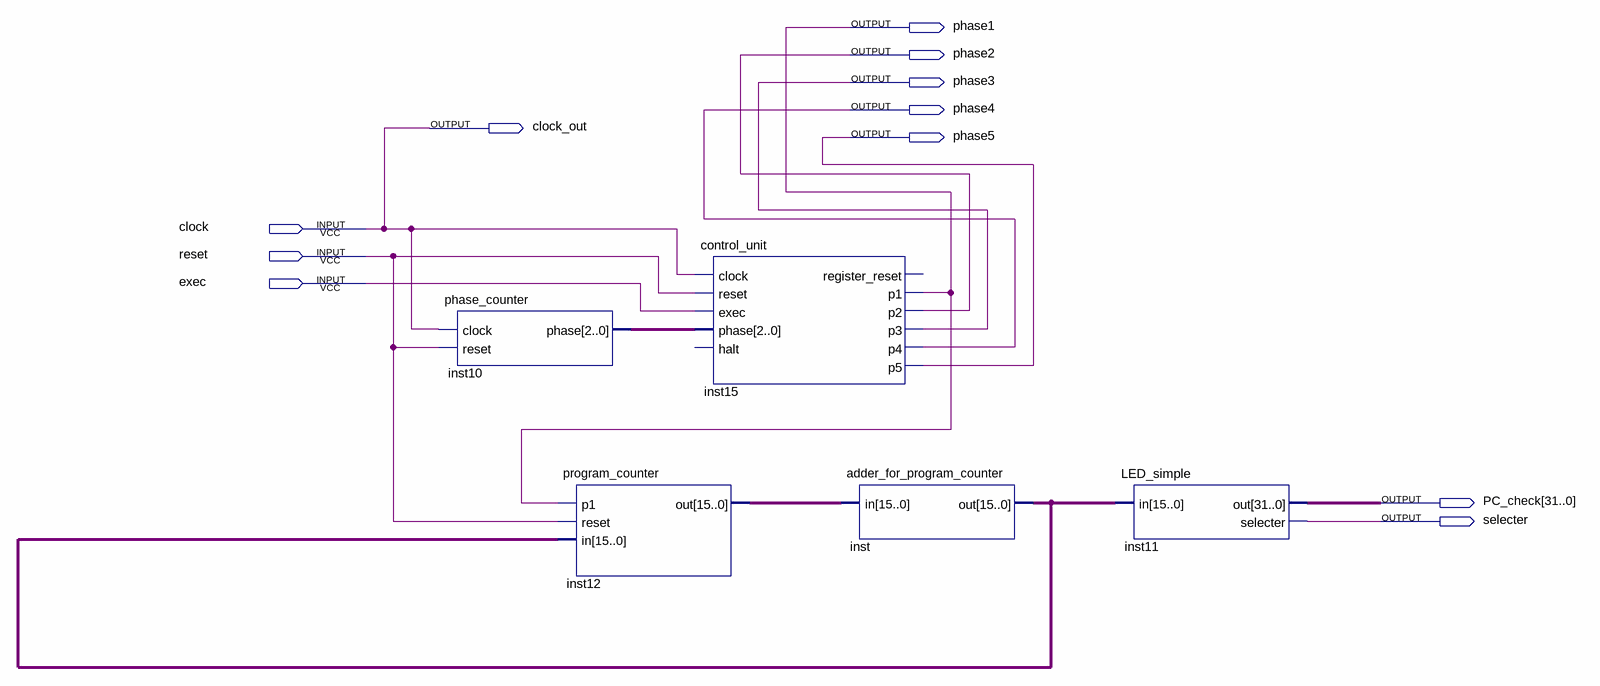
[diagram p0: schematic sheet]
// Quartus schematic processor_p1.bdf as structural Verilog: 5 symbols, 11 pins
module processor_p1 (
  input  clock,
  input  reset,
  input  exec,
  output phase1,
  output phase2,
  output phase3,
  output phase4,
  output clock_out,
  output phase5,
  output [31:0] PC_check,
  output selecter
);

  wire [2:0] inst10_phase;
  wire [15:0] inst12_out, inst_out;

  phase_counter inst10 (.clock(clock), .reset(reset), .phase(inst10_phase));
  program_counter inst12 (.p1(phase1), .reset(reset), .in(inst_out), .out(inst12_out));
  control_unit inst15 (
    .clock(clock), .reset(reset), .exec(exec), .phase(inst10_phase), .p1(phase1), .p2(phase2), .p3(phase3),
    .p4(phase4), .p5(phase5));  // open: halt, register_reset
  adder_for_program_counter inst (.in(inst12_out), .out(inst_out));
  LED_simple inst11 (.in(inst_out), .out(PC_check), .selecter(selecter));

  assign clock_out = clock;
endmodule
